# Altium schematic sheet TOP.SchDoc
size A4
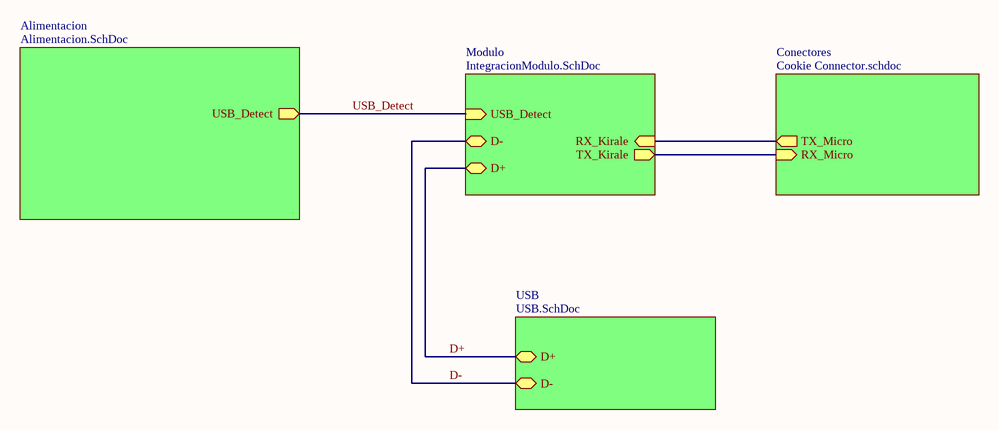
[diagram p0: TOP.SchDoc]

## Sub-sheets
Alimentacion = Alimentacion.SchDoc: USB_Detect (out)
Conectores = Cookie Connector.schdoc: RX_Micro (in), TX_Micro (out)
Modulo = IntegracionModulo.SchDoc: RX_Kirale (in), TX_Kirale (out), USB_Detect (in), D+ (bidir), D- (bidir)
USB = USB.SchDoc: D- (bidir), D+ (bidir)

## Nets
D+: sheet Modulo/D+, sheet USB/D+
D-: sheet Modulo/D-, sheet USB/D-
USB_Detect: sheet Modulo/USB_Detect, sheet Alimentacion/USB_Detect
(unnamed): sheet Modulo/RX_Kirale, sheet Conectores/TX_Micro
(unnamed): sheet Modulo/TX_Kirale, sheet Conectores/RX_Micro